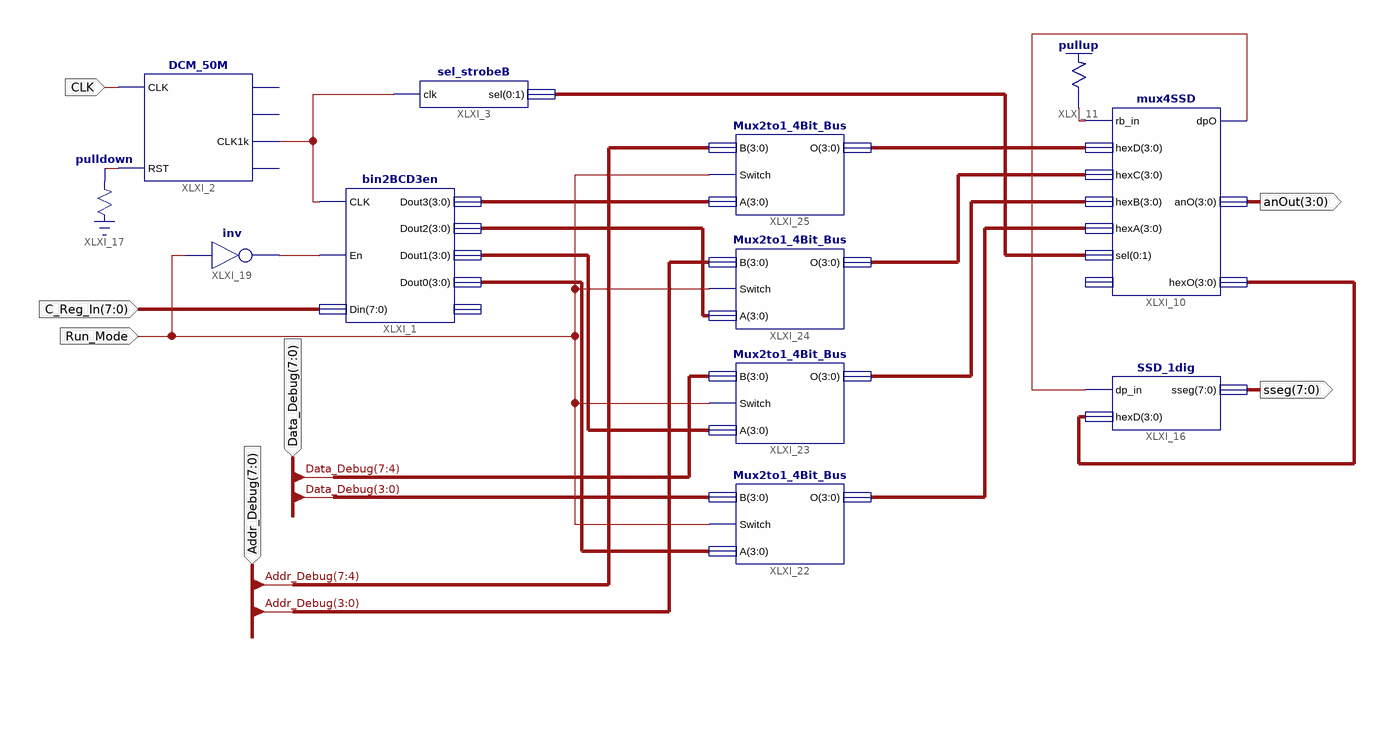
[diagram p0: schematic sheet 1]
// Xilinx ISE schematic Sseg_Display.sch (spartan3e) as structural Verilog: 12 symbols, 7 ports
module Sseg_Display (
  input  [7:0] C_Reg_In,
  input  CLK,
  input  Run_Mode,
  input  [7:0] Data_Debug,
  input  [7:0] Addr_Debug,
  output [3:0] anOut,
  output [7:0] sseg
);

  wire RST, XLXN_3, XLXN_16, XLXN_41, XLXN_44;
  wire [1:0] XLXN_23;
  wire [3:0] XLXN_18, XLXN_19, XLXN_20, XLXN_25, XLXN_37, XLXN_38, XLXN_39, XLXN_40, XLXN_54;

  DCM_50M XLXI_2 (.CLK(CLK), .RST(RST), .CLK1k(XLXN_3));  // open: CLK1M, CLK10k, CLK1
  \pulldown  XLXI_17 (.O(RST));
  SSD_1dig XLXI_16 (.dp_in(XLXN_41), .hexD(XLXN_54), .sseg(sseg));
  not XLXI_19 (XLXN_44, Run_Mode);
  bin2BCD3en XLXI_1 (
    .CLK(XLXN_3), .En(XLXN_44), .Din(C_Reg_In), .Dout3(XLXN_18), .Dout2(XLXN_19), .Dout1(XLXN_20),
    .Dout0(XLXN_25));  // open: RBout
  sel_strobeB XLXI_3 (.clk(XLXN_3), .sel({XLXN_23[0], XLXN_23[1]}));
  \pullup  XLXI_11 (.O(XLXN_16));
  Mux2to1_4Bit_Bus XLXI_22 (.B(Data_Debug[3:0]), .Switch(Run_Mode), .A(XLXN_25), .O(XLXN_40));
  Mux2to1_4Bit_Bus XLXI_23 (.B(Data_Debug[7:4]), .Switch(Run_Mode), .A(XLXN_20), .O(XLXN_39));
  Mux2to1_4Bit_Bus XLXI_24 (.B(Addr_Debug[3:0]), .Switch(Run_Mode), .A(XLXN_19), .O(XLXN_38));
  Mux2to1_4Bit_Bus XLXI_25 (.B(Addr_Debug[7:4]), .Switch(Run_Mode), .A(XLXN_18), .O(XLXN_37));
  mux4SSD XLXI_10 (
    .rb_in(XLXN_16), .hexD(XLXN_37), .hexC(XLXN_38), .hexB(XLXN_39), .hexA(XLXN_40),
    .sel({XLXN_23[0], XLXN_23[1]}), .dpO(XLXN_41), .anO(anOut), .hexO(XLXN_54));  // open: dp_in
endmodule
